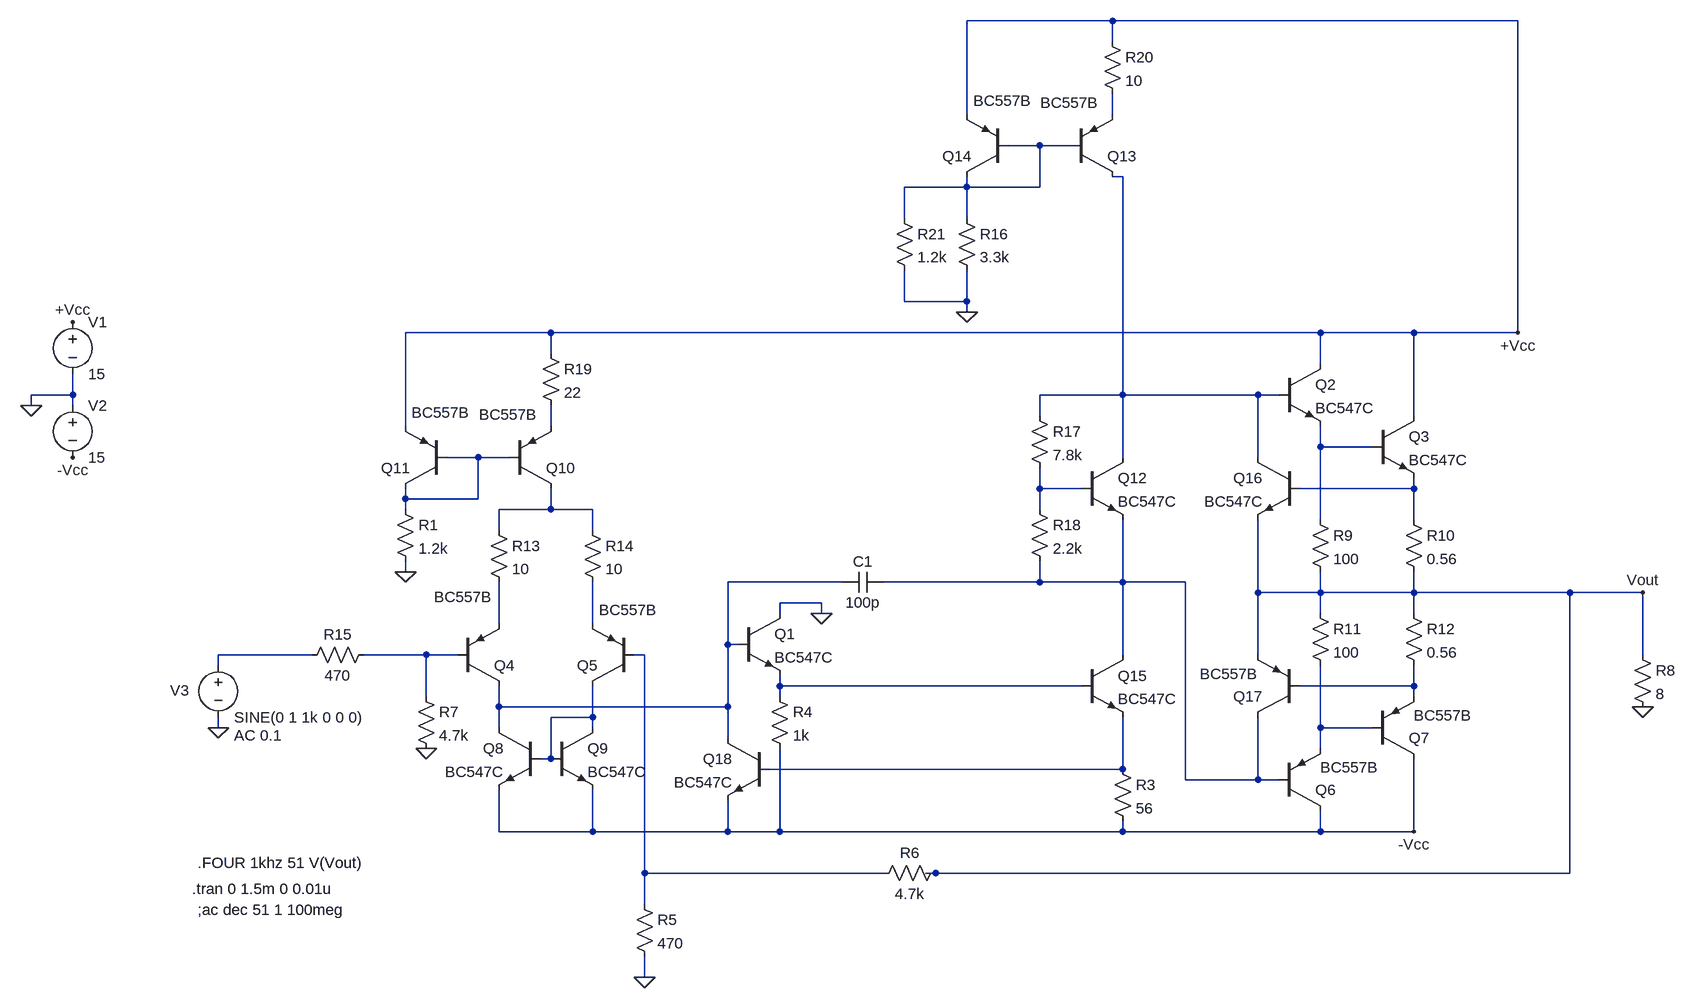
[diagram p0: schematic AmpBasico.asc]
AmpBasico.asc, the LTspice schematic file:
Version 4
SHEET 1 2472 680
WIRE 912 -816 688 -816
WIRE 1536 -816 912 -816
WIRE 912 -784 912 -816
WIRE 688 -672 688 -816
WIRE 912 -672 912 -704
WIRE 800 -624 752 -624
WIRE 848 -624 800 -624
WIRE 928 -576 912 -576
WIRE 688 -560 688 -576
WIRE 688 -560 592 -560
WIRE 800 -560 800 -624
WIRE 800 -560 688 -560
WIRE 592 -512 592 -560
WIRE 688 -512 688 -560
WIRE 592 -384 592 -432
WIRE 688 -384 688 -432
WIRE 688 -384 592 -384
WIRE 688 -368 688 -384
WIRE 48 -336 -176 -336
WIRE 1232 -336 48 -336
WIRE 1376 -336 1232 -336
WIRE 1536 -336 1536 -816
WIRE 1536 -336 1376 -336
WIRE 48 -304 48 -336
WIRE 1232 -288 1232 -336
WIRE -688 -240 -688 -272
WIRE -688 -240 -752 -240
WIRE 928 -240 928 -576
WIRE 928 -240 800 -240
WIRE 1136 -240 928 -240
WIRE 1168 -240 1136 -240
WIRE -752 -224 -752 -240
WIRE -688 -224 -688 -240
WIRE 800 -208 800 -240
WIRE 1376 -208 1376 -336
WIRE -176 -192 -176 -336
WIRE 48 -192 48 -224
WIRE 1232 -160 1232 -192
WIRE 1312 -160 1232 -160
WIRE -64 -144 -112 -144
WIRE -16 -144 -64 -144
WIRE 928 -144 928 -240
WIRE 1136 -144 1136 -240
WIRE 800 -96 800 -128
WIRE 864 -96 800 -96
WIRE 1376 -96 1376 -112
WIRE 1376 -96 1200 -96
WIRE -176 -80 -176 -96
WIRE -64 -80 -64 -144
WIRE -64 -80 -176 -80
WIRE -176 -64 -176 -80
WIRE 48 -64 48 -96
WIRE 48 -64 -32 -64
WIRE 112 -64 48 -64
WIRE 800 -64 800 -96
WIRE 1232 -48 1232 -160
WIRE 1376 -48 1376 -96
WIRE -32 -32 -32 -64
WIRE 112 -32 112 -64
WIRE -176 32 -176 16
WIRE 496 48 320 48
WIRE 800 48 800 16
WIRE 800 48 560 48
WIRE 928 48 928 -48
WIRE 928 48 800 48
WIRE 1024 48 928 48
WIRE 1136 64 1136 -48
WIRE 1232 64 1232 32
WIRE 1232 64 1136 64
WIRE 1376 64 1376 32
WIRE 1376 64 1232 64
WIRE 1616 64 1376 64
WIRE 1728 64 1616 64
WIRE 464 80 400 80
WIRE 400 96 400 80
WIRE 464 96 464 80
WIRE 1232 96 1232 64
WIRE 1376 96 1376 64
WIRE -32 112 -32 48
WIRE 112 112 112 48
WIRE 320 144 320 48
WIRE 336 144 320 144
WIRE -320 160 -464 160
WIRE -144 160 -240 160
WIRE -96 160 -144 160
WIRE 192 160 176 160
WIRE 928 160 928 48
WIRE 1136 160 1136 64
WIRE 1728 160 1728 64
WIRE -464 176 -464 160
WIRE 400 208 400 192
WIRE 864 208 400 208
WIRE 1376 208 1376 176
WIRE 1376 208 1200 208
WIRE -144 224 -144 160
WIRE 400 224 400 208
WIRE 1376 224 1376 208
WIRE -32 240 -32 208
WIRE 320 240 320 144
WIRE 320 240 -32 240
WIRE 112 256 112 208
WIRE 112 256 48 256
WIRE -464 272 -464 256
WIRE -32 272 -32 240
WIRE 112 272 112 256
WIRE 1232 272 1232 176
WIRE 1312 272 1232 272
WIRE 320 288 320 240
WIRE 1232 304 1232 272
WIRE 48 320 48 256
WIRE 48 320 32 320
WIRE 928 336 928 256
WIRE 928 336 384 336
WIRE 1024 352 1024 48
WIRE 1136 352 1136 256
WIRE 1136 352 1024 352
WIRE 1168 352 1136 352
WIRE -32 432 -32 368
WIRE 112 432 112 368
WIRE 112 432 -32 432
WIRE 320 432 320 384
WIRE 320 432 112 432
WIRE 400 432 400 304
WIRE 400 432 320 432
WIRE 928 432 928 416
WIRE 928 432 400 432
WIRE 1232 432 1232 400
WIRE 1232 432 928 432
WIRE 1376 432 1376 320
WIRE 1376 432 1232 432
WIRE 192 496 192 160
WIRE 560 496 192 496
WIRE 640 496 624 496
WIRE 1616 496 1616 64
WIRE 1616 496 640 496
WIRE 192 544 192 496
WIRE 192 656 192 624
FLAG -464 272 0
FLAG -752 -224 0
FLAG -688 -352 +Vcc
FLAG 1536 -336 +Vcc
FLAG -688 -144 -Vcc
FLAG 1728 240 0
FLAG 192 656 0
FLAG 1728 64 Vout
FLAG -144 304 0
FLAG 688 -368 0
FLAG 464 96 0
FLAG 1376 432 -Vcc
FLAG -176 32 0
SYMBOL pnp -96 208 M180
WINDOW 3 -36 137 Left 2
SYMATTR Value BC557B
SYMATTR InstName Q4
SYMBOL pnp 176 208 R180
WINDOW 3 -35 117 Left 2
SYMATTR Value BC557B
SYMATTR InstName Q5
SYMBOL res 176 528 R0
SYMATTR InstName R5
SYMATTR Value 470
SYMBOL voltage -688 -368 R0
WINDOW 123 0 0 Left 2
WINDOW 39 0 0 Left 2
SYMATTR InstName V1
SYMATTR Value 15
SYMBOL voltage -688 -240 R0
WINDOW 123 0 0 Left 2
WINDOW 39 0 0 Left 2
SYMATTR InstName V2
SYMATTR Value 15
SYMBOL voltage -464 160 R0
WINDOW 123 24 124 Left 2
WINDOW 39 24 152 Left 2
WINDOW 0 -74 55 Left 2
SYMATTR Value2 AC 0.1
SYMATTR InstName V3
SYMATTR Value SINE(0 1 1k 0 0 0)
SYMBOL res 1712 144 R0
SYMATTR InstName R8
SYMATTR Value 8
SYMBOL res 656 480 R90
WINDOW 0 0 56 VBottom 2
WINDOW 3 32 56 VTop 2
SYMATTR InstName R6
SYMATTR Value 4.7k
SYMBOL npn 336 96 R0
SYMATTR InstName Q1
SYMATTR Value BC547C
SYMBOL cap 560 32 R90
WINDOW 0 0 32 VBottom 2
WINDOW 3 32 32 VTop 2
SYMATTR InstName C1
SYMATTR Value 100p
SYMBOL res -160 208 R0
SYMATTR InstName R7
SYMATTR Value 4.7k
SYMBOL res -48 -48 R0
SYMATTR InstName R13
SYMATTR Value 10
SYMBOL res 96 -48 R0
SYMATTR InstName R14
SYMATTR Value 10
SYMBOL res -224 144 R90
WINDOW 0 0 56 VBottom 2
WINDOW 3 32 56 VTop 2
SYMATTR InstName R15
SYMATTR Value 470
SYMBOL npn 32 272 M0
SYMATTR InstName Q8
SYMATTR Value BC547C
SYMBOL npn 48 272 R0
SYMATTR InstName Q9
SYMATTR Value BC547C
SYMBOL pnp -16 -96 M180
WINDOW 3 -47 114 Left 2
SYMATTR Value BC557B
SYMATTR InstName Q10
SYMBOL pnp -112 -96 R180
WINDOW 3 -35 117 Left 2
SYMATTR Value BC557B
SYMATTR InstName Q11
SYMBOL res -192 -80 R0
SYMATTR InstName R1
SYMATTR Value 1.2k
SYMBOL res 672 -528 R0
SYMATTR InstName R16
SYMATTR Value 3.3k
SYMBOL pnp 848 -576 M180
WINDOW 3 -47 114 Left 2
SYMATTR Value BC557B
SYMATTR InstName Q13
SYMBOL pnp 752 -576 R180
WINDOW 3 -35 117 Left 2
SYMATTR Value BC557B
SYMATTR InstName Q14
SYMBOL npn 864 160 R0
SYMATTR InstName Q15
SYMATTR Value BC547C
SYMBOL res 912 320 R0
SYMATTR InstName R3
SYMATTR Value 56
SYMBOL res 384 208 R0
SYMATTR InstName R4
SYMATTR Value 1k
SYMBOL npn 864 -144 R0
SYMATTR InstName Q12
SYMATTR Value BC547C
SYMBOL res 784 -224 R0
SYMATTR InstName R17
SYMATTR Value 7.8k
SYMBOL res 784 -80 R0
SYMATTR InstName R18
SYMATTR Value 2.2k
SYMBOL npn 1168 -288 R0
SYMATTR InstName Q2
SYMATTR Value BC547C
SYMBOL npn 1312 -208 R0
SYMATTR InstName Q3
SYMATTR Value BC547C
SYMBOL res 1216 -64 R0
SYMATTR InstName R9
SYMATTR Value 100
SYMBOL pnp 1168 400 M180
WINDOW 3 64 67 Left 2
SYMATTR Value BC557B
SYMATTR InstName Q6
SYMBOL res 1216 80 R0
SYMATTR InstName R11
SYMATTR Value 100
SYMBOL pnp 1312 320 M180
WINDOW 3 64 67 Left 2
SYMATTR Value BC557B
SYMATTR InstName Q7
SYMBOL res 1360 -64 R0
SYMATTR InstName R10
SYMATTR Value 0.56
SYMBOL res 1360 80 R0
SYMATTR InstName R12
SYMATTR Value 0.56
SYMBOL npn 1200 -144 M0
SYMATTR InstName Q16
SYMATTR Value BC547C
SYMBOL pnp 1200 256 R180
WINDOW 3 64 67 Left 2
SYMATTR Value BC557B
SYMATTR InstName Q17
SYMBOL res 32 -320 R0
SYMATTR InstName R19
SYMATTR Value 22
SYMBOL res 896 -800 R0
SYMATTR InstName R20
SYMATTR Value 10
SYMBOL res 576 -528 R0
SYMATTR InstName R21
SYMATTR Value 1.2k
SYMBOL npn 384 288 M0
SYMATTR InstName Q18
SYMATTR Value BC547C
TEXT -504 520 Left 2 !.tran 0 1.5m 0 0.01u
TEXT -496 480 Left 2 !.FOUR 1khz 51 V(Vout)
TEXT -496 552 Left 2 !;ac dec 51 1 100meg

The netlist it stands for:
* AmpBasico.asc
Q4 N010 N015 N012 0 BC557B
Q5 N019 N016 N013 0 BC557B
R5 N016 0 470
V1 +Vcc 0 15
V2 0 -Vcc 15
V3 N014 0 SINE(0 1 1k 0 0 0) AC 0.1
R8 Vout 0 8
R6 Vout N016 4.7k
Q1 0 N010 N017 0 BC547C
C1 N011 N010 100p
R7 N015 0 4.7k
R13 N009 N012 10
R14 N009 N013 10
R15 N015 N014 470
Q8 N010 N019 -Vcc 0 BC547C
Q9 N019 N019 -Vcc 0 BC547C
Q10 N009 N006 N004 0 BC557B
Q11 N006 N006 +Vcc 0 BC557B
R1 N006 0 1.2k
R16 N002 0 3.3k
Q13 N003 N002 N001 0 BC557B
Q14 N002 N002 +Vcc 0 BC557B
Q15 N011 N017 N021 0 BC547C
R3 N021 -Vcc 56
R4 N017 -Vcc 1k
Q12 N003 N007 N011 0 BC547C
R17 N003 N007 7.8k
R18 N007 N011 2.2k
Q2 +Vcc N003 N005 0 BC547C
Q3 +Vcc N005 N008 0 BC547C
R9 N005 Vout 100
Q6 -Vcc N011 N020 0 BC557B
R11 Vout N020 100
Q7 -Vcc N020 N018 0 BC557B
R10 N008 Vout 0.56
R12 Vout N018 0.56
Q16 N003 N008 Vout 0 BC547C
Q17 N011 N018 Vout 0 BC557B
R19 +Vcc N004 22
R20 +Vcc N001 10
R21 N002 0 1.2k
Q18 N010 N021 -Vcc 0 BC547C
.model NPN NPN
.model PNP PNP
.lib standard.bjt
.tran 0 1.5m 0 0.01u
.FOUR 1khz 51 V(Vout)
;ac dec 51 1 100meg
.backanno
.end